# Altium schematic sheet eps_batt_JULY2019.SchDoc: Battery Protection
size A4; DrawnBy: J. Reimer T. Yeung M. Au; Organization: UTAT SS; DocumentNumber: 4; Revision: 2.0; SheetNumber: 4; SheetTotal: 17
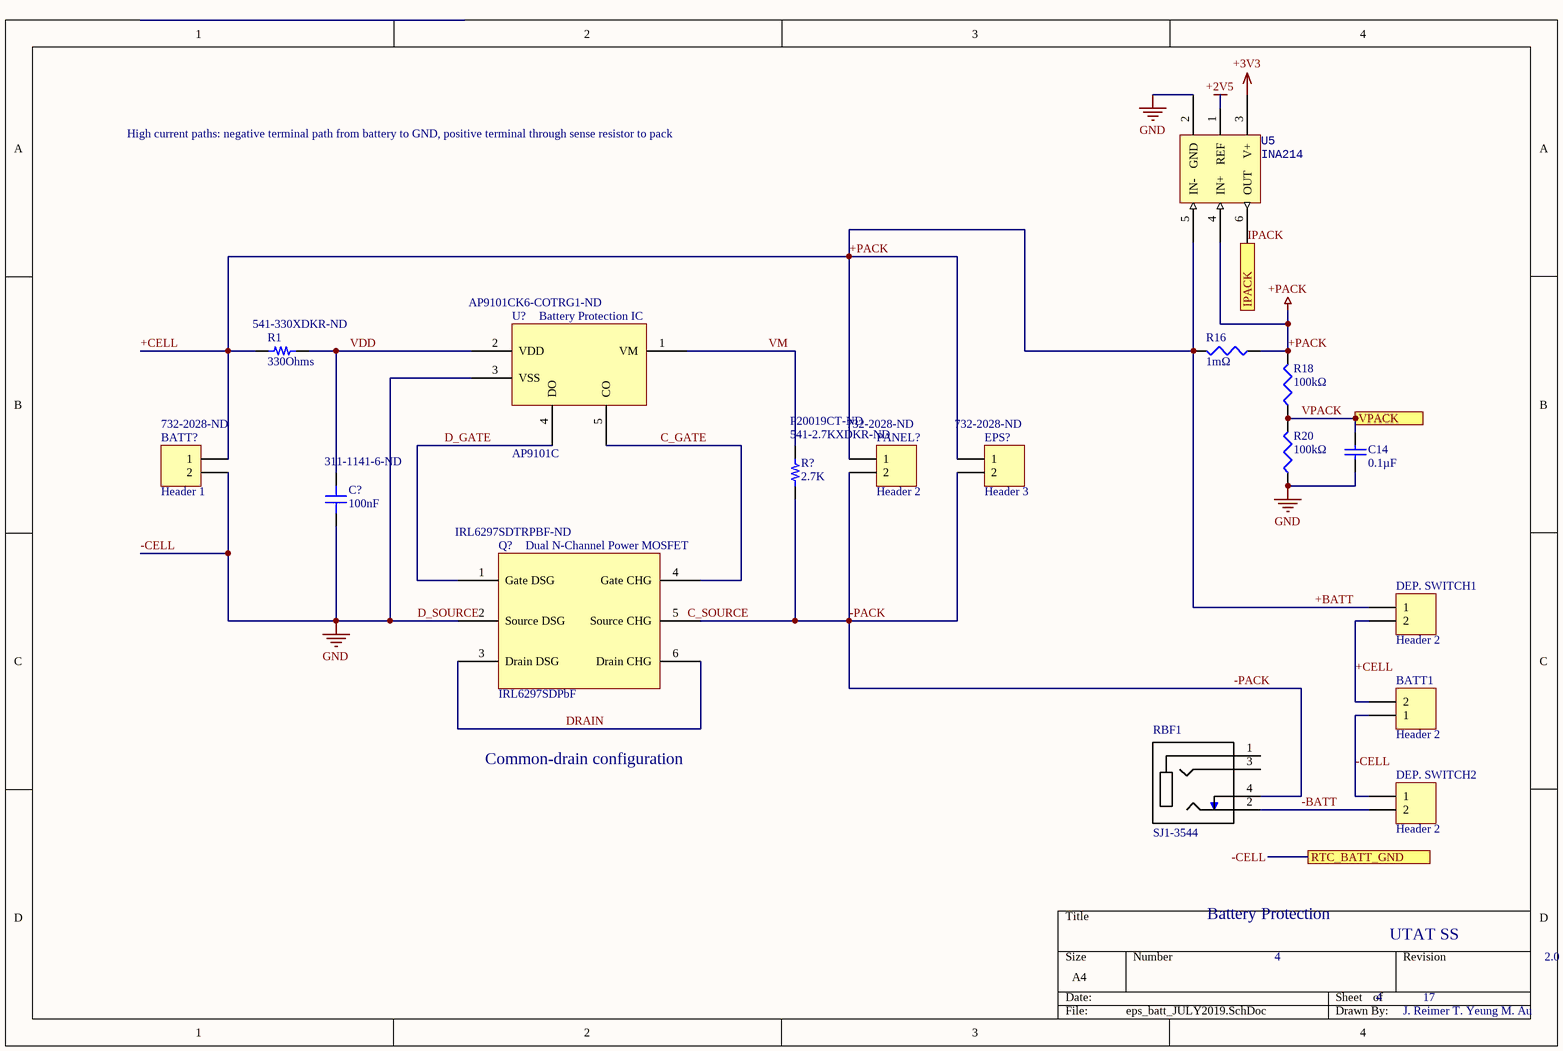
[diagram p0: eps_batt_JULY2019.SchDoc]

## Parts
BATT1  Header 2  [WM1351-ND]
BATT?  Header 1  Supplier Part Number 1: 732-2028-ND  [SAM9552-ND]
C14  0.1µF  [1608[0603]]
C?  100nF  Supplier Part Number 1: 311-1141-6-ND  [1608[0603]]
DEP._SWITCH1  Header 2  [WM1351-ND]
DEP._SWITCH2  Header 2  [WM1351-ND]
EPS?  Header 3  Supplier Part Number 1: 732-2028-ND  [CON2_SCREW_5.00MM_691102710002]
PANEL?  Header 2  Supplier Part Number 1: 732-2028-ND  [CON2_SCREW_5.00MM_691102710002]
Q?  IRL6297SDPbF  Supplier Part Number 1: IRL6297SDTRPBF-ND  [IRL6297SDPbF]
R1  330Ohms  Supplier Part Number 1: 541-330XDKR-ND  [1608[0603]]
R16  1mΩ  [C1206]
R18  100kΩ  [J1-0603]
R20  100kΩ  [J1-0603]
R?  2.7K  Supplier Part Number 1: 541-2.7KXDKR-ND  Supplier Part Number 2: P20019CT-ND  [1608[0603]]
RBF1  SJ1-3544  [SJ1-3544]
U5  INA214  [SOT65P210X110-6N]
U?  AP9101C  Supplier Part Number 1: AP9101CK6-COTRG1-ND  [AP9101C-776313]

## Ports
IPACK (out), RTC_BATT_GND, VPACK (out)

## Nets
+2V5: U5.1(REF)
+3V3: U5.3(V+)
+BATT: BATT1.2 BATT?.1 DEP._SWITCH1.1 DEP._SWITCH1.2 EPS?.1 PANEL?.1 R1.1 R16.1 R16.2 R18.2 U5.4(IN+) U5.5(IN-)  [also labelled +CELL, +PACK]
-CELL: BATT1.1 BATT?.2 C14.1 C?.1 DEP._SWITCH2.1 Q?.2(Source_DSG) R20.1 U5.2(GND) U?.3(VSS) ; port RTC_BATT_GND  [also labelled D_SOURCE, GND]
-BATT: DEP._SWITCH2.2 RBF1.2
-PACK: EPS?.2 PANEL?.2 Q?.5(Source_CHG) R?.1 RBF1.4
C_GATE: Q?.4(Gate_CHG) U?.5(CO)
D_GATE: Q?.1(Gate_DSG) U?.4(DO)
DRAIN: Q?.3(Drain_DSG) Q?.6(Drain_CHG)
IPACK: U5.6(OUT) ; port IPACK
VDD: C?.2 R1.2 U?.2(VDD)
VM: R?.2 U?.1(VM)
VPACK: C14.2 R18.1 R20.2 ; port VPACK

Not connected (* = marked no-connect by the designer): RBF1 1 3

## Notes on the sheet
- High current paths: negative terminal path from battery to GND, positive terminal through sense resistor to pack
- (near U?) Battery Protection IC
- (near Q?) Dual N-Channel Power MOSFET
- Common-drain configuration
- Labels drawn without touching a wire or pin: C_SOURCE

## Library data of the parts
BATT1 = Header 2: Battery Header, 2-Pin; LatestRevisionDate: 17-Jul-2002; LatestRevisionNote: Re-released for DXP Platform.; Publisher: Altium Limited; Supplier 1: Digi-Key; Supplier Part Number 1: WM1351-ND
BATT? EPS? PANEL? = Header 2: Header, 2-Pin; Manufacturer: Wurth Electronics; Manufacturer Part Number: 691102710002; Plating: Steel; Voltage Rating: 300V; Current Rating: 15A; Number of Levels: 1; Number of Positions Per Level: 2; Wire/Cable Gauge: 22AWG; Wire Gauge (Min): 14AWG; Pitch: 0.197inch; Stripping Length: -6mm; LatestRevisionDate: 17-Jul-2002; LatestRevisionNote: Re-released for DXP Platform.; Publisher: Altium Limited; Supplier 1: Digi-Key; Stock 1: 734; Pricing 1: 1=0.69, 10=0.616, 50=0.532, 100=0.5 (USD); Mount: Through Hole; Contact Material: Brass; Color: Blue; Contact Plating: Tin; Housing Material: Nylon; Min Operating Temperature: -40°C; Max Operating Temperature: 105°C; Package Quantity: 900; Packaging: Bulk; Current: 15A; Voltage: 300V; Termination: Screw; Number of Contacts: 2; Length: 7.5mm; Height: 13.4mm; Width: 11.2mm; Wire Gauge (Max): 22AWG; REACH SVHC: Unknown; ComponentLink1URL: https://katalog.we-online.de/em/datasheet/6911027100xx.pdf?src-supplier=Digi-Key; ComponentLink1Description: https://katalog.we-online.de/em/datasheet/6911027100xx.pdf?src-supplier=Digi-Key; ComponentLink2URL: http://www.produktinfo.conrad.com/datenblaetter/1000000-1099999/001088592-da-01-en-WR_TBL_TERMINAL_BLOCK102_691102710002.pdf?src-supplier=Conrad; ComponentLink2Description: http://www.produktinfo.conrad.com/datenblaetter/1000000-1099999/001088592-da-01-en-WR_TBL_TERMINAL_BLOCK102_691102710002.pdf?src-supplier=Conrad
C14 = Cap Semi: Capacitor (Semiconductor SIM Model); Published: 8-Jun-2000; LatestRevisionDate: 29-May-2009; LatestRevisionNote: IPC-7351 Footprint Added.; PackageReference: C1206; Publisher: Altium Limited; PackageDescription: Chip Capacitor; Value: 0.1µF
C? = Capacitor: SMT Capacitor; Manufacturer: Yageo; Manufacturer Part Number: CC0805KRX7R8BB104; Value: 0.1uF; Material: Ceramic; Voltage Rating: 25V; Tolerance: 10%; Dielectric: X7R; Insulation Resistance: 100GR; Supplier 1: Digi-Key; Stock 1: 1166693; Pricing 1: 1=0.13, 10=0.092, 100=0.0433, 500=0.0304, 1000=0.02516 (USD); Mount: Surface Mount; Case/Package: 0805; Number of Pins: 2; Case Code (Metric): 2012; Case Code (Imperial): 0805; Min Operating Temperature: -55°C; Max Operating Temperature: 125°C; Package Quantity: 1; Capacitance: 100nF; Packaging: Tape and Reel; Voltage Rating (DC): 25V; Termination: SMD/SMT; Composition: Ceramic; Length: 2mm; Height: 0.85mm; Width: 0.049inch; Thickness: 0.033inch; Depth: 1.25mm; Radiation Hardening: No; REACH SVHC: No SVHC; Lead Free: Lead Free; Halogen Free: Halogen Free; ComponentLink1URL: http://www.yageo.com/documents/recent/UPY-GPHC_X7R_6.3V-to-50V_18.pdf?src-supplier=Digi-Key; ComponentLink1Description: http://www.yageo.com/documents/recent/UPY-GPHC_X7R_6.3V-to-50V_18.pdf?src-supplier=Digi-Key; ComponentLink2URL: http://www.farnell.com/datasheets/1489800.pdf?src-supplier=Element14; ComponentLink2Description: http://www.farnell.com/datasheets/1489800.pdf?src-supplier=Element14; ComponentLink3URL: http://www.farnell.com/datasheets/1850775.pdf?src-supplier=Element14; ComponentLink3Description: http://www.farnell.com/datasheets/1850775.pdf?src-supplier=Element14; ComponentLink4URL: https://www.verical.com/server-webapp/html/getDatasheet?partID=330244&src-supplier=Verical; ComponentLink4Description: https://www.verical.com/server-webapp/html/getDatasheet?partID=330244&src-supplier=Verical; ComponentLink5URL: http://www.yageo.com/documents/recent/UPY-GPHC_X7R_6.3V-to-50V_8.pdf?src-supplier=Avnet+Europe; ComponentLink5Description: http://www.yageo.com/documents/recent/UPY-GPHC_X7R_6.3V-to-50V_8.pdf?src-supplier=Avnet+Europe; ComponentLink6URL: http://www.farnell.com/datasheets/1784427.pdf?src-supplier=Element14; ComponentLink6Description: http://www.farnell.com/datasheets/1784427.pdf?src-supplier=Element14; ComponentLink7URL: http://www.farnell.com/datasheets/70765.pdf?src-supplier=Element14; ComponentLink7Description: http://www.farnell.com/datasheets/70765.pdf?src-supplier=Element14
DEP._SWITCH1 = Header 2: High-side deployment switch, 2-Pin; LatestRevisionDate: 17-Jul-2002; LatestRevisionNote: Re-released for DXP Platform.; Publisher: Altium Limited; Supplier 1: Digi-Key; Supplier Part Number 1: WM1351-ND
DEP._SWITCH2 = Header 2: Low-side deployment switch, 2-Pin; LatestRevisionDate: 17-Jul-2002; LatestRevisionNote: Re-released for DXP Platform.; Publisher: Altium Limited; Supplier 1: Digi-Key; Supplier Part Number 1: WM1351-ND
Q? = IRL6297SDPbF: Dual N-Channel Power MOSFET; Manufacturer: International Rectifier; Manufacturer Part Number: IRL6297SDTRPBF; Rds On Max: 4.9mR; Input Capacitance: 2.245nF; Drain to Source Voltage (Vdss): 20V; Continuous Drain Current (ID): 15A; Max Power Dissipation: 1.7W; Threshold Voltage: 800mV; FET Type: 2 N-Channel; Number of Elements: 2; Supplier 1: Digi-Key; Stock 1: 0; Mount: Surface Mount; Number of Pins: 8; Min Operating Temperature: -40°C; Max Operating Temperature: 150°C; Packaging: Tape and Reel; Package Quantity: 4800; Gate to Source Voltage (Vgs): 20V; Power Dissipation: 1.7W; REACH SVHC: No SVHC; Lead Free: Lead Free; ComponentLink1URL: http://www.irf.com/product-info/datasheets/data/irl6297sdpbf.pdf?src-supplier=Digi-Key; ComponentLink1Description: http://www.irf.com/product-info/datasheets/data/irl6297sdpbf.pdf?src-supplier=Digi-Key
R1 = Resistor: SMT Resistor; Manufacturer: Vishay Dale; Manufacturer Part Number: CRCW2512330RJNEG; Value: 1K; Resistance: 330R; Tolerance: 5%; Power Rating: 1W; Voltage Rating: 500V; Temperature Coefficient: 200ppm/°C; Supplier 1: Digi-Key; Stock 1: 42562; Pricing 1: 1=0.38, 10=0.318, 100=0.1242, 1000=0.05198 (USD); Mount: Surface Mount; Case/Package: 2512; Number of Pins: 2; Weight: 0.001429oz; Case Code (Metric): 6432; Case Code (Imperial): 2512; Contact Plating: Tin; Min Operating Temperature: -55°C; Max Operating Temperature: 155°C; Package Quantity: 1; Packaging: Tape and Reel; Composition: Thick Film; Number of Terminations: 2; Military Standard: Not; Termination: Solder; Max Power Dissipation: 1W; Voltage Rating (DC): 500V; Features: Automotive AEC-Q200; Length: 6.3mm; Height: 0.6mm; Width: 0.124inch; Depth: 3.15mm; Radiation Hardening: No; REACH SVHC: Unknown; Lead Free: Lead Free; ComponentLink1URL: http://www.vishay.com/docs/20035/dcrcwe3.pdf?src-supplier=Digi-Key; ComponentLink1Description: http://www.vishay.com/docs/20035/dcrcwe3.pdf?src-supplier=Digi-Key; ComponentLink2URL: http://www.vishay.com/docs/20035/dcrcwe3.pdf?src-supplier=Avnet; ComponentLink2Description: http://www.vishay.com/docs/20035/dcrcwe3.pdf?src-supplier=Avnet; ComponentLink3URL: https://www.alliedelec.com/m/d/0c934d6939ccefa68dbe0b96d821c8cf.pdf?src-supplier=Allied+Electronics; ComponentLink3Description: https://www.alliedelec.com/m/d/0c934d6939ccefa68dbe0b96d821c8cf.pdf?src-supplier=Allied+Electronics; ComponentLink4URL: http://www.vishay.com/docs/20035/dcrcwe3.pdf?src-supplier=Future+Electronics; ComponentLink4Description: http://www.vishay.com/docs/20035/dcrcwe3.pdf?src-supplier=Future+Electronics; ComponentLink5URL: http://www.farnell.com/datasheets/1847332.pdf?src-supplier=Element14; ComponentLink5Description: http://www.farnell.com/datasheets/1847332.pdf?src-supplier=Element14; ComponentLink6URL: http://www.mouser.com/ds/2/427/dcrcwe3-109170.pdf?src-supplier=Mouser; ComponentLink6Description: http://www.mouser.com/ds/2/427/dcrcwe3-109170.pdf?src-supplier=Mouser
R16 R18 R20 = Res3: Resistor; Published: 8-Jun-2000; LatestRevisionDate: 29-May-2009; LatestRevisionNote: IPC-7351 Footprint Added.; PackageReference: J1-0603; Publisher: Altium Limited; PackageDescription: Chip Resistor
  R16: Value: 1mΩ; Supplier 1: Digi-Key; Supplier Part Number 1: P.010AVDKR-ND
  R18: Value: 100kΩ; Supplier 1: Digi-Key; Supplier Part Number 1: 541-100KHCT-ND
  R20: Value: 100kΩ
R? = Resistor: SMT Resistor; Manufacturer: Vishay Dale; Manufacturer Part Number: CRCW25122K70JNEG; Value: 1K; Tolerance: 5%; Power Rating: 1W; Voltage Rating: 500V; Resistance: 2.7kR; Temperature Coefficient: 200ppm/°C; Supplier 1: Digi-Key; Stock 1: 6589; Pricing 1: 1=0.38, 10=0.318, 100=0.1242, 1000=0.05198 (USD); Case/Package: 2512; Number of Pins: 2; Weight: 0.001429oz; Case Code (Imperial): 2512; Case Code (Metric): 6432; Contact Plating: Tin; Min Operating Temperature: -55°C; Max Operating Temperature: 155°C; Packaging: Tape and Reel; Package Quantity: 2000; Termination: SMD/SMT; Composition: Thick Film; Number of Terminations: 2; Military Standard: Not; Max Power Dissipation: 1W; Voltage Rating (DC): 500V; Features: Automotive AEC-Q200; Length: 6.3mm; Height: 0.028inch; Width: 3.15mm; Depth: 3.15mm; Radiation Hardening: No; Lead Free: Lead Free; REACH SVHC: Unknown; ComponentLink1URL: http://www.mouser.com/ds/2/427/dcrcwe3-109170.pdf?src-supplier=Mouser; ComponentLink1Description: http://www.mouser.com/ds/2/427/dcrcwe3-109170.pdf?src-supplier=Mouser; ComponentLink2URL: http://www.vishay.com/docs/20035/dcrcwe3.pdf?src-supplier=Avnet; ComponentLink2Description: http://www.vishay.com/docs/20035/dcrcwe3.pdf?src-supplier=Avnet; ComponentLink3URL: http://www.farnell.com/datasheets/2045674.pdf?src-supplier=Element14; ComponentLink3Description: http://www.farnell.com/datasheets/2045674.pdf?src-supplier=Element14; ComponentLink4URL: http://www.vishay.com/docs/20035/dcrcwe3.pdf?src-supplier=Digi-Key; ComponentLink4Description: http://www.vishay.com/docs/20035/dcrcwe3.pdf?src-supplier=Digi-Key; Supplier 2: Digi-Key; Stock 2: 1266; Pricing 2: 1=0.25, 10=0.211, 25=0.1532, 50=0.111, 100=0.0823, 250=0.06316, 500=0.04976, 1000=0.03445 (USD); Height - Seated (Max): 0.022inch
U5 = INA214: Current monitor; Supplier 1: Digi-Key; Supplier Part Number 1: 296-38956-1-ND
U? = AP9101C: Battery Protection IC; Manufacturer: Diodes; Manufacturer Part Number: AP9101CK6-COTRG1; Supplier 1: Digi-Key; Stock 1: 0; Pricing 1: 3000=0.12375 (USD); Case/Package: SOT-23-6; Packaging: Tape and Reel
RBF1 = SJ1-3544: Value: *; Supplier 1: Digi-Key; Supplier Part Number 1: CP1-3544-ND